# EAGLE design ESP_ART_NET (EAGLE 7.5.0)
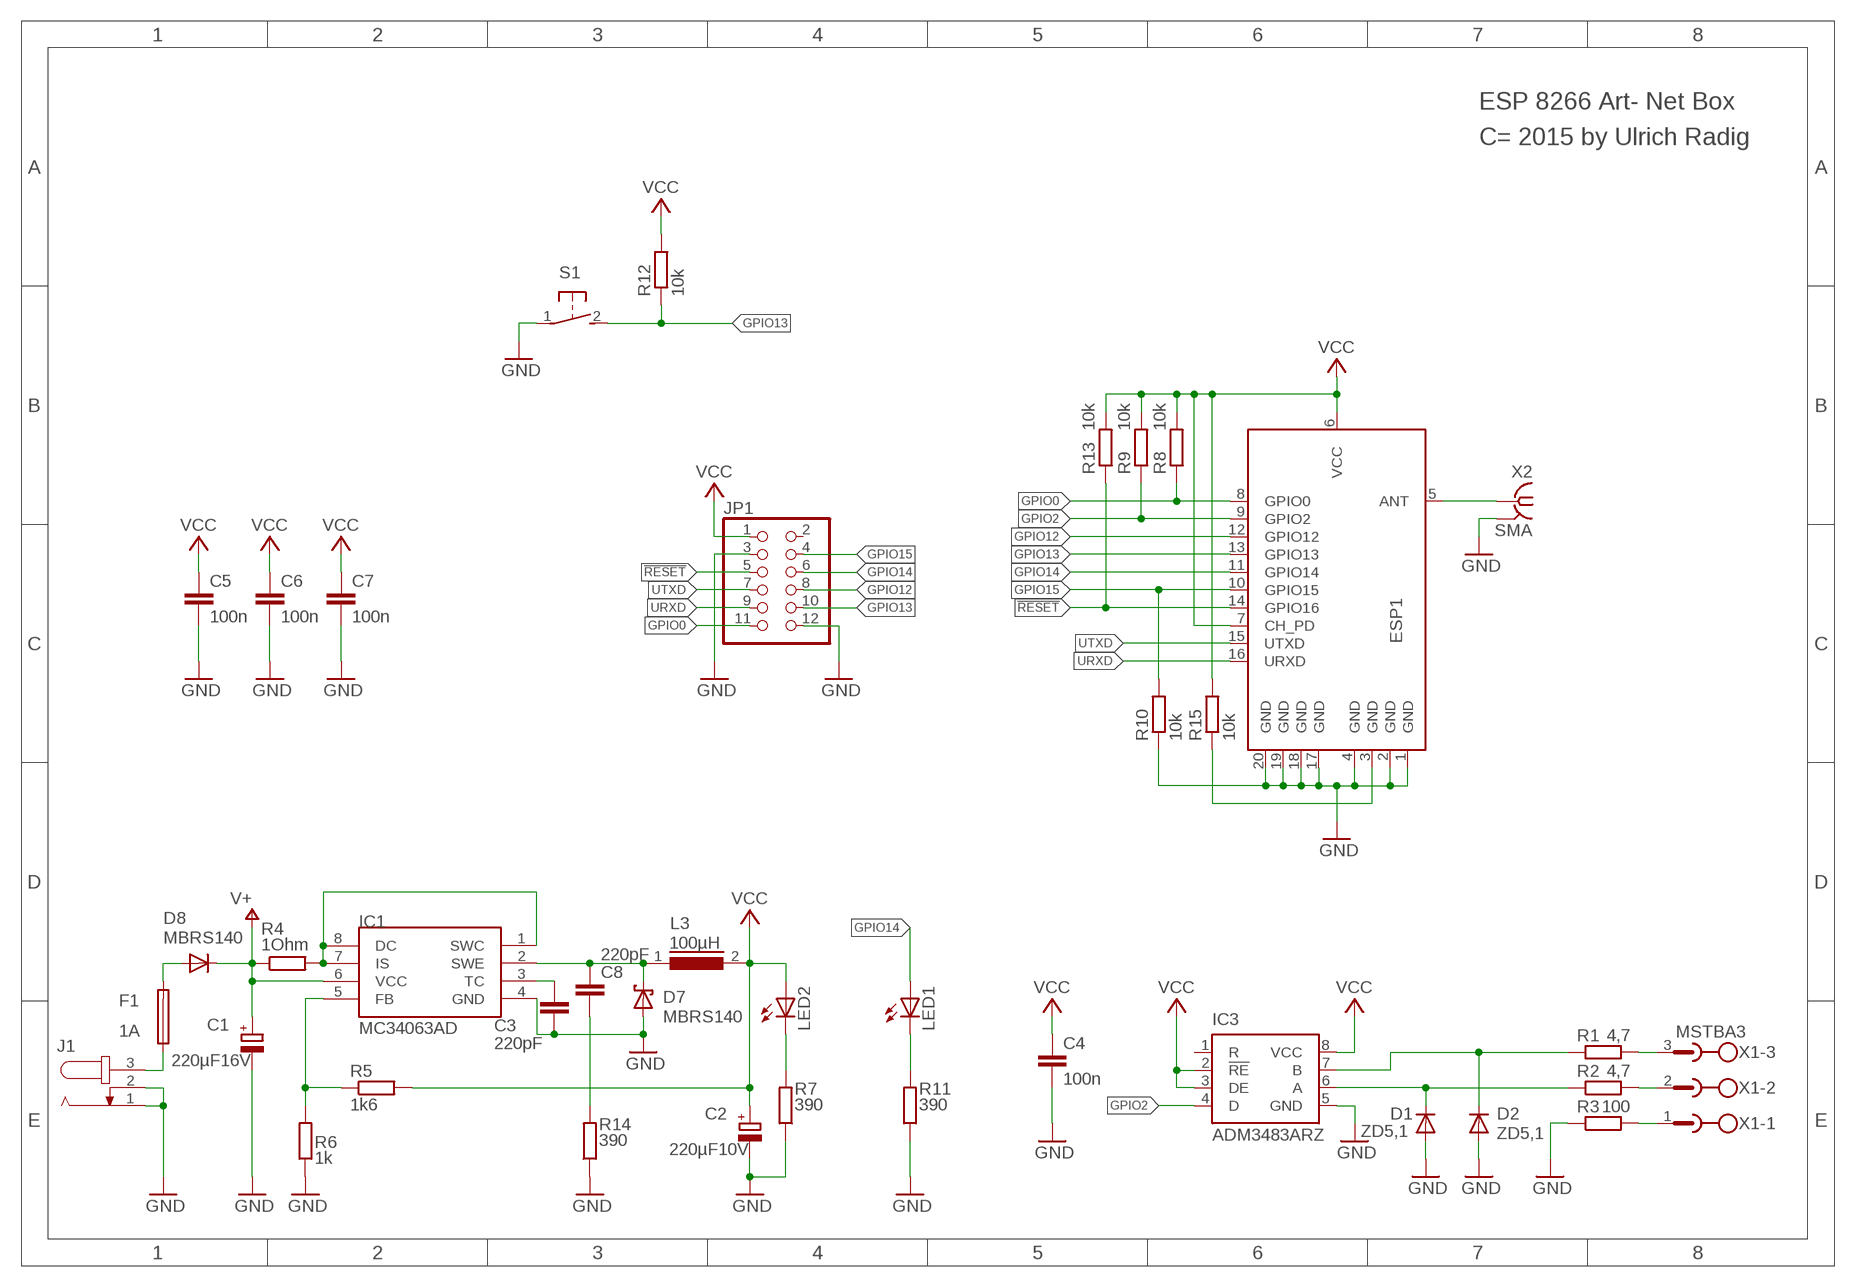
[diagram p0: schematic, sheet 1]

## Parts
C1  220µF16V  CPOL-EUE5-8.5  [E5-8,5]
C2  220µF10V  CPOL-EUE2.5-7  [E2,5-7]
C3  220pF  C-EUC0805  [C0805]
C4  100n  C-EUC0805  [C0805]
C5  100n  C-EUC0805  [C0805]
C6  100n  C-EUC0805  [C0805]
C7  100n  C-EUC0805  [C0805]
C8  220pF  C-EUC0805  [C0805]
D1  ZD5,1  PMLL4150  [SOD80C]
D2  ZD5,1  PMLL4150  [SOD80C]
D7  MBRS140  SCHOTTKY-DIODESMD  [SMB]
D8  MBRS140  DIODE-SMB  [SMB]
ESP1  ESP8266MOD  [ESP8266MOD]
F1  1A  PICOFUSE  [PICOFUSE]
IC1  MC34063AD  [SOIC8]
IC3  ADM3483ARZ  SN65176D  [SO-08]
J1  JACK-PLUG1  [SPC4078]
JP1  PINHD-2X6  [2X06]
L3  100µH  SLF7045  [SLF7045]
LED1  LEDCHIPLED_1206  [CHIPLED_1206]
LED2  LEDCHIPLED_1206  [CHIPLED_1206]
R1  4,7  R-EU_R0805  [R0805]
R2  4,7  R-EU_R0805  [R0805]
R3  100  R-EU_R0805  [R0805]
R4  1Ohm  R-EU_0207/10  [0207/10]
R5  1k6  R-EU_M0805  [M0805]
R6  1k  R-EU_M0805  [M0805]
R7  390  R-EU_R0805  [R0805]
R8  10k  R-EU_R0805  [R0805]
R9  10k  R-EU_R0805  [R0805]
R10  10k  R-EU_R0805  [R0805]
R11  390  R-EU_R0805  [R0805]
R12  10k  R-EU_R0805  [R0805]
R13  10k  R-EU_R0805  [R0805]
R14  390  R-EU_R0805  [R0805]
R15  10k  R-EU_R0805  [R0805]
S1  31-XX  [B3F-31XX]
X1  MSTBA3  [MSTBA3]
X2  SMA  SMA-142-0701-801/806  [J502-ND-142-0701-801/806]

## Nets
!RESET: ESP1.14(GPIO16) JP1.5 R13.1
GND: C1.- C2.- C3.2 C4.2 C5.2 C6.2 C7.2 D1.A D2.A D7.A ESP1.1(GND) ESP1.2(GND) ESP1.4(GND) ESP1.17(GND) ESP1.18(GND) ESP1.19(GND) ESP1.20(GND) IC1.4(GND) IC3.5(GND) J1.1 J1.2 JP1.3 JP1.12 R3.1 R6.1 R7.1 R10.1 R11.1 R14.1 S1.1(P) X2.G@1(GND)
GPIO0: ESP1.8(GPIO0) JP1.11 R8.1
GPIO2: ESP1.9(GPIO2) IC3.4(D) R9.1
GPIO12: ESP1.12(GPIO12) JP1.8
GPIO13: ESP1.13(GPIO13) JP1.10 R12.1 S1.2(S)
GPIO14: ESP1.11(GPIO14) JP1.6 LED1.A
GPIO15: ESP1.10(GPIO15) JP1.4 R10.2
N$1: LED2.C R7.2
N$2: ESP1.5(ANT) X2.1
N$3: LED1.C R11.2
N$4: D1.C IC3.6(A) R2.1
N$5: D2.C IC3.7(B) R1.1
N$6: R3.2 X1.1
N$7: R2.2 X1.2
N$8: R1.2 X1.3
N$9: C8.2 R14.2
N$10: ESP1.3(GND) R15.1
N$51: IC1.5(FB) R5.1 R6.2
N$52: C3.1 IC1.3(TC)
N$53: IC1.1(SWC) IC1.7(IS) IC1.8(DC) R4.2
N$54: C8.1 D7.C IC1.2(SWE) L3.1
N$57: D8.A F1.2
N$58: F1.1 J1.3
URXD: ESP1.16(URXD) JP1.9
UTXD: ESP1.15(UTXD) JP1.7
V+: C1.+ D8.C IC1.6(VCC) R4.1
VCC: C2.+ C4.1 C5.1 C6.1 C7.1 ESP1.6(VCC) ESP1.7(CH_PD) IC3.2(!RE) IC3.3(DE) IC3.8(VCC) JP1.1 L3.2 LED2.A R5.2 R8.2 R9.2 R12.2 R13.2 R15.2
Unconnected: IC3.1(R) JP1.2

## Notes on the sheet
- ESP 8266 Art- Net Box
- C= 2015 by Ulrich Radig

## Power pins joined to a net without a drawn wire
GND: X2.G@2(GND) X2.G@3(GND) X2.G@4(GND)

## Library data of the parts
C1 C2 = rcl:CPOL-EU: POLARIZED CAPACITOR, European symbol
C3-C8 = rcl:C-EU: CAPACITOR, European symbol
D1 D2 = diode:PMLL4150: DIODE high speed
D7 = diode:SCHOTTKY-DIODE: Schottky Diode
D8 = diode:DIODE-: DIODE
ESP1 = ESP8266:ESP8266MOD
F1 = fuse:PICOFUSE: PICOFUSE 19275, Wickmann
IC1 = mc34063:MC34063
IC3 = texas:SN65176: DIFFERENTIAL BUS TRANSCEIVER Source: http://focus.ti.com .. sn65176b.pdf
J1 = con-jack:JACK-PLUG: DC POWER JACK Power Jack, DC, Right Angle, Through Hole, Rated 5A at 16VDC, PC Terminals Distributor: Farnell (www.Farnell.de) Drawing: 84N1161.pdf / 84N1162.pdf Manufacturer: SPC Technology (www.spctechnology.com) Type: SPC4077 / SPC 4078
JP1 = pinhead:PINHD-2X6: PIN HEADER
L3 = inductors:SLF7045: SMD Inductors(Coils) For Power Line (Wound, Magnetic Shielded) Source: TDK, e531_slf7045.pdf
LED1 LED2 = led:LED: LED OSRAM: - CHIPLED LG R971, LG N971, LY N971, LG Q971, LY Q971, LO R971, LY R971 LH N974, LH R974 LS Q976, LO Q976, LY Q976 LO Q996 - Hyper CHIPLED LW Q18S LB Q993, LB Q99A, LB R99A - SideLED LS A670, LO A670, LY A670, LG A670, LP A670 LB A673, LV A673, LT A673, LW A673 LH A674 LY A675 LS A676, LA A676, LO A676, LY A676, LW A676 LS A679, LY A679, LG A679 - Hyper Micro SIDELED® LS Y876, LA Y876, LO Y876, LY Y876 LT Y87S - SmartLED LW L88C, LW L88S LB L89C, LB L89S, LG L890 LS L89K, LO L89K, LY L89K LS L896, LA L896, LO L896, LY L896 - TOPLED LS T670, LO T670, LY T670, LG T670, LP T670 LSG T670, LSP T670, LSY T670, LOP T670, LYG T670 LG T671, LOG T671, LSG T671 LB T673, LV T673, LT T673, LW T673 LH T674 LS T676, LA T676, LO T676, LY T676, LB T676, LH T676, LSB T676, LW T676 LB T67C, LV T67C, LT T67C, LS T67K, LO T67K, LY T67K, LW E67C LS E67B, LA E67B, LO E67B, LY E67B, LB E67C, LV E67C, LT E67C LW T67C LS T679, LY T679, LG T679 LS T770, LO T770, LY T770, LG T770, LP T770 LB T773, LV T773, LT T773, LW T773 LH T774 LS E675, LA E675, LY E675, LS T675 LS T776, LA T776, LO T776, LY T776, LB T776 LHGB T686 LT T68C, LB T68C - Hyper Mini TOPLED® LB M676 - Mini TOPLED Santana® LG M470 LS M47K, LO M47K, LY M47K Source: http://www.osram.convergy.de LUXEON: - LUMILED® LXK2-PW12-R00, LXK2-PW12-S00, LXK2-PW14-U00, LXK2-PW14-V00 LXK2-PM12-R00, LXK2-PM12-S00, LXK2-PM14-U00 LXK2-PE12-Q00, LXK2-PE12-R00, LXK2-PE12-S00, LXK2-PE14-T00, LXK2-PE14-U00 LXK2-PB12-K00, LXK2-PB12-L00, LXK2-PB12-M00, LXK2-PB14-N00, LXK2-PB14-P00, LXK2-PB14-Q00 LXK2-PR12-L00, LXK2-PR12-M00, LXK2-PR14-Q00, LXK2-PR14-R00 LXK2-PD12-Q00, LXK2-PD12-R00, LXK2-PD12-S00 LXK2-PH12-R00, LXK2-PH12-S00 LXK2-PL12-P00, LXK2-PL12-Q00, LXK2-PL12-R00 Source: www.luxeon.com KINGBRIGHT: KA-3528ASYC Source: www.kingbright.com
R1-R15 = rcl:R-EU_: RESISTOR, European symbol
S1 = switch-omron:31-XX: OMRON SWITCH
X1 = con-phoenix-508:MSTBA3: PHOENIX
X2 = con-coax:SMA-: SMA 50 Ohm End Launch Jack Receptacle - Round Contact Johnson Components Source: www.johnsoncomponents.com .. J502-ND.pdf

## Board
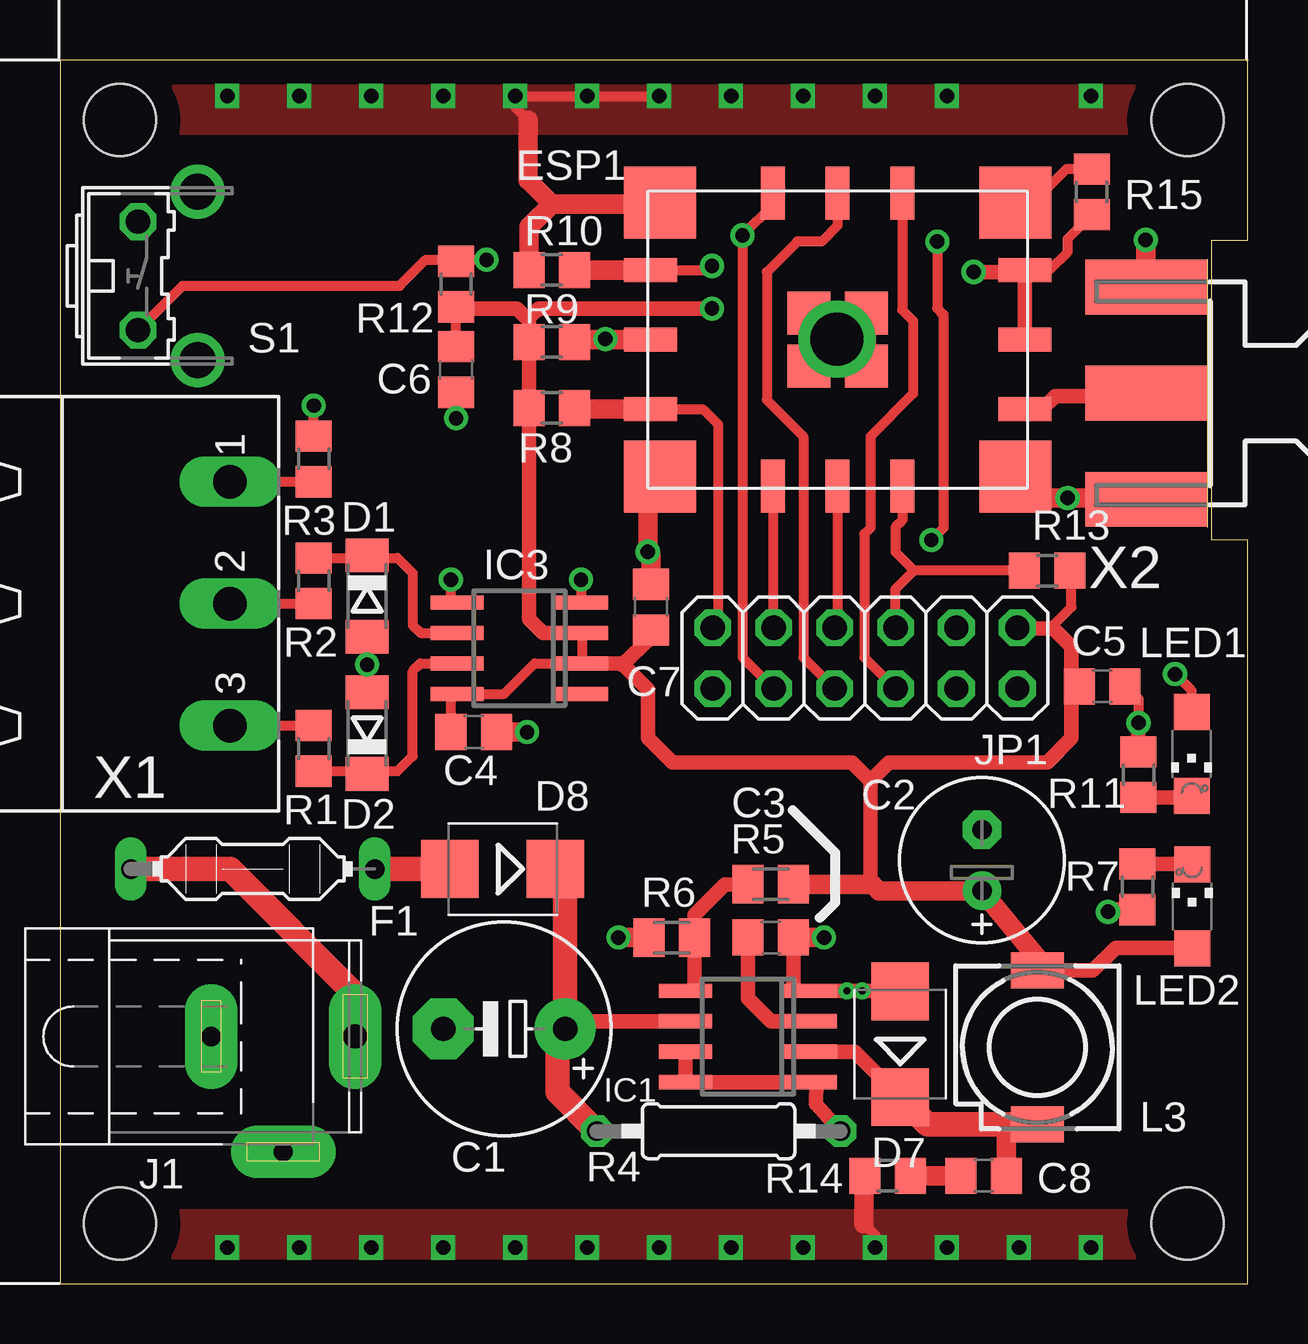
[diagram p1: board, top side]
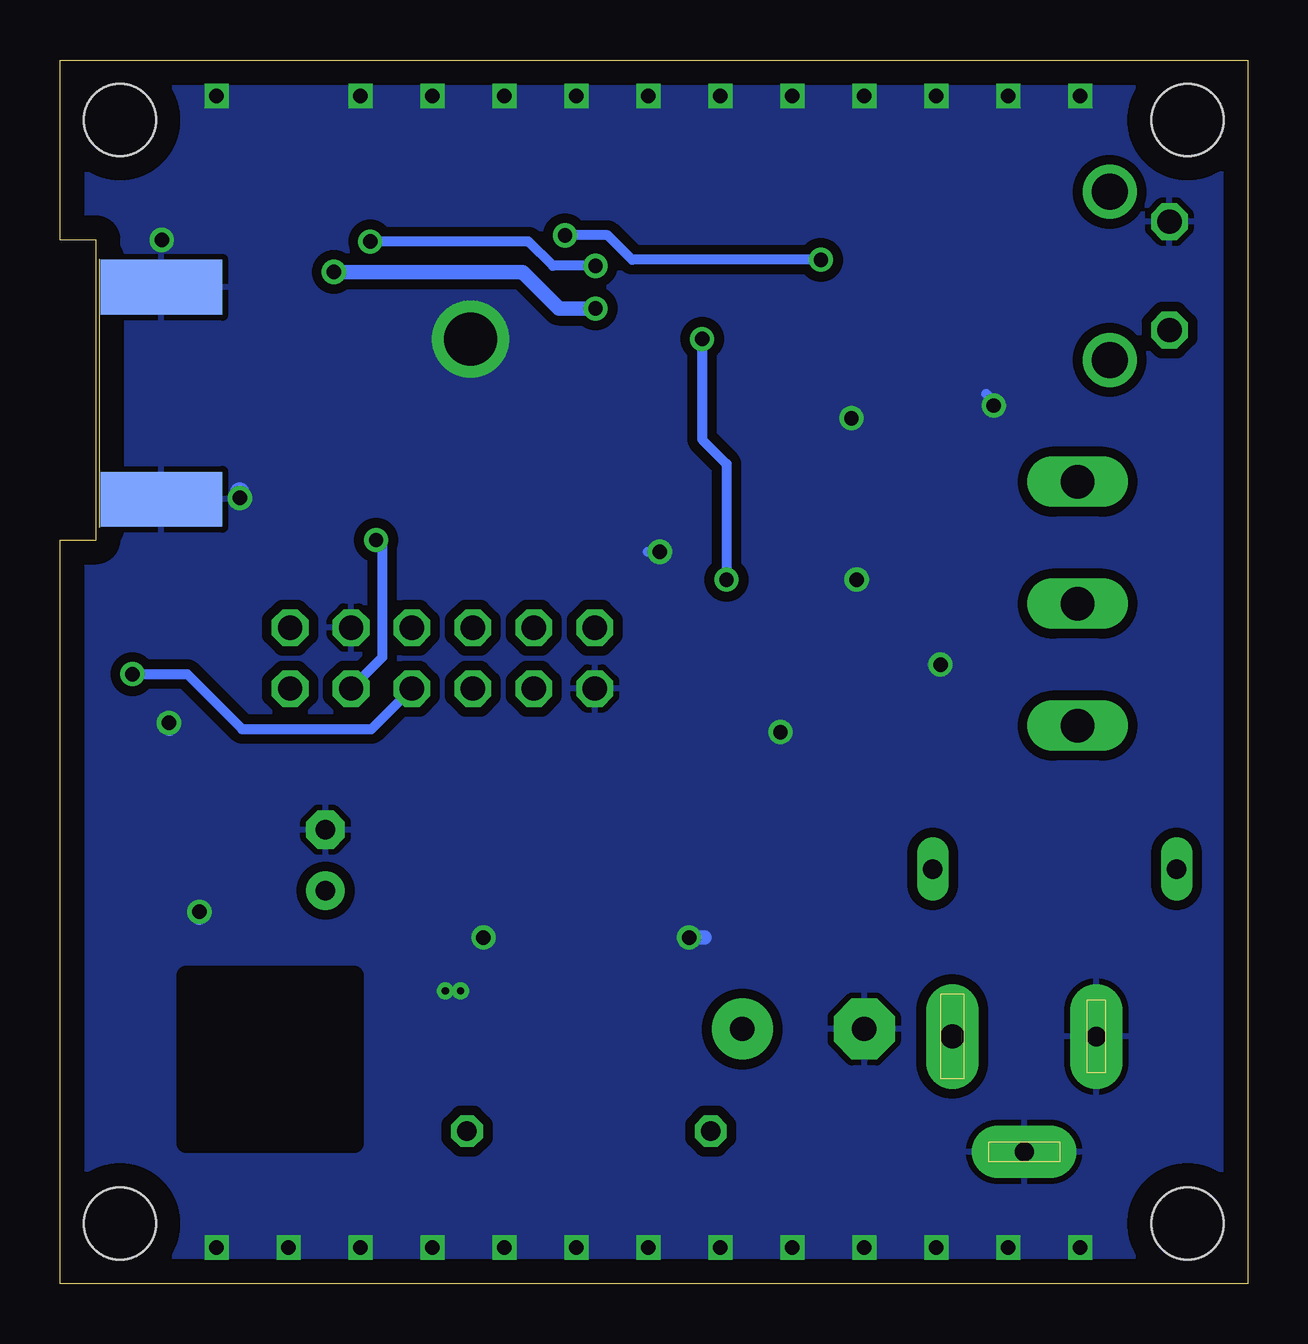
[diagram p2: board, bottom side, seen from below]

Size 49.5 x 51 mm. Coordinates in mm from the lower left corner, seen from the top.
Outline: 0,0 49.5,0 49.5,31 48,31 48,43.5 49.5,43.5 49.5,51 0,51 0,0
Copper layers (1*16): Top 0.035mm / dielectric 1.5mm / Bottom 0.035mm
Design rules "default": minimum track width 10mil, minimum drill 24mil, track to track 8mil, track to pad 8mil, pad to pad 8mil, via to via 8mil, smd to smd 8mil, copper to edge 40mil, drill to drill 8mil, minimum pad ring 10mil, minimum via ring 8mil, stop-mask expansion 4mil, vias tented up to drill 0mil, thermal gap 10mil
Holes 3 mm at 47,48.5 47,2.5 2.5,2.5 2.5,48.5
bRestrict: area 37.2,5.9 to 44.2,12.8

### Footprints (pad centres in the part's own frame; a part is rotated, then mirrored left to right if it is on the bottom)
E5-8,5 = drill 1.016 pad 2.54: + -2.54,0 | drill 1.016 pad 2.54 octagon: - 2.54,0
E2,5-7 = drill 0.813 pad 1.6: + -1.27,0 | drill 0.813 pad 1.6 octagon: - 1.27,0
C0805 = smd 1.3 x 1.5: 1 -0.95,0; 2 0.95,0
SOD80C = smd 1.4 x 1.8: A 1.7,0; C -1.7,0
SMB = smd 2.4 x 2.4: A 2.2,0; C -2.2,0
ESP8266MOD = smd 3 x 3: 1 -7.4,5.7; 2 7.4,5.7; 3 -7.4,-5.7; 4 7.4,-5.7 | smd 2.2 x 1: 5 -7.8,2.9; 6 -7.8,0; 7 -7.8,-2.9; 8 7.8,2.9; 9 7.8,0; 10 7.8,-2.9 | smd 1 x 2.2: 11 -2.7,-6.1; 12 0,-6.1; 13 2.7,-6.1; 14 -2.7,6.1; 15 0,6.1; 16 2.7,6.1 | smd 1.8 x 1.8: 17 -1.2,1.1; 18 1.2,1.1; 19 -1.2,-1.1; 20 1.2,-1.1
PICOFUSE = drill 0.813 long: 1 -5.08,0; 2 5.08,0
SOIC8 = smd 0.6 x 2.2: 1 -1.905,-2.6; 2 -0.635,-2.6; 3 0.635,-2.6; 4 1.905,-2.6; 5 1.905,2.6; 6 0.635,2.6; 7 -0.635,2.6; 8 -1.905,2.6
SO-08 = smd 0.6 x 2.2: 1 -1.905,-2.6; 2 -0.635,-2.6; 3 0.635,-2.6; 4 1.905,-2.6; 5 1.905,2.6; 6 0.635,2.6; 7 -0.635,2.6; 8 -1.905,2.6
SPC4078 = drill 0.8 pad 2.184 long: 1 -3,0; 2 0,-4.8 | drill 1 pad 2.184 long: 3 3,0
2X06 = drill 1.016 octagon: 1 -6.35,-1.27; 2 -6.35,1.27; 3 -3.81,-1.27; 4 -3.81,1.27; 5 -1.27,-1.27; 6 -1.27,1.27; 7 1.27,-1.27; 8 1.27,1.27; 9 3.81,-1.27; 10 3.81,1.27; 11 6.35,-1.27; 12 6.35,1.27
SLF7045 = smd 1.5 x 2.2: 1 -3.2,0; 2 3.2,0
CHIPLED_1206 = smd 1.5 x 1.5: A 0,-1.75; C 0,1.75
R0805 = smd 1.3 x 1.5: 1 -0.95,0; 2 0.95,0
0207/10 = drill 0.813 octagon: 1 -5.08,0; 2 5.08,0
M0805 = smd 1.3 x 1.6: 1 -0.95,0; 2 0.95,0
B3F-31XX = drill 1.016 octagon: 1 -2.261,-1.245; 2 2.261,-1.245 | drill 1.499 pad 2.159: 3 -3.505,1.245; 4 3.505,1.245
MSTBA3 = drill 1.397 long: 1 -5.08,5.08; 2 0,5.08; 3 5.08,5.08
J502-ND-142-0701-801/806 = smd 5.08 x 2.286: 1 2.565,0; G@1 2.565,4.42; G@2 2.565,-4.42 | smd 5.08 x 2.286 bottom: G@3 2.565,4.42; G@4 2.565,-4.42

### Placement (x,y rotation side)
C1  18.52,10.61 180 top
C2  38.43,17.64 90 top
C3  29.63,14.42 0 top
C4  17.25,22.99 0 top
C5  43.43,24.89 0 top
C6  16.51,38.1 270 top
C7  24.64,28.19 90 top
C8  38.5,4.5 180 top
D1  12.8,28.66 270 top
D2  12.8,22.94 90 top
D7  35.02,9.98 90 top
D8  18.45,17.28 180 top
ESP1  32.41,39.34 180 top
F1  8.04,17.28 0 top
IC1  28.68,10.29 90 top
IC3  19.15,26.48 90 top
J1  9.31,10.29 0 top
JP1  33.56,26.07 180 top
L3  40.74,9.84 90 top
LED1  47.17,22.07 180 top
LED2  47.19,15.72 0 top
R1  10.58,22.3 90 top
R2  10.58,29.29 270 top
R3  10.58,34.37 270 top
R4  27.45,6.35 0 top
R5  29.63,16.64 0 top
R6  25.5,14.42 0 top
R7  44.91,16.54 90 top
R8  20.5,36.5 180 top
R9  20.5,39.25 180 top
R10  20.5,42.25 0 top
R11  44.96,21.21 270 top
R12  16.51,41.66 270 top
R13  41.15,29.72 0 top
R14  34.5,4.5 0 top
R15  43,45.5 270 top
S1  4.5,42 270 top
X1  2,28.34 270 top
X2  47.84,37.11 180 top

### Tracks (layer width: path | path; a pad name or v marks a point on that pad's centre or on a via)
!RESET
  Top 0.406: JP1.5 34.83,28.96 35.59,29.72 | ESP1.14 35.11,31.81 34.83,31.52 34.83,30.48 35.59,29.72 | R13.1 35.59,29.72
GND  (via drill 0.3, 0.6, 2.2)
  Top 0.406: R3.1 v10.58,36.59 | D2.A v12.8,25.8 D1.A | IC3.5 16.29,28.39 v16.29,29.34 | v32.38,39.37 33.48,39.37 33.61,39.5 | C5.2 44.45,24.89 44.96,24.38 v44.96,23.37 | C6.2 v16.51,36.07 | R14.1 33.5,4.45 | 33.5,2.5 33.98,2.02 v33.98,1.5 | ESP1.2 25.01,33.01 24.5,32.5 | 25.01,49.46 19.04,49.46 19,49.5 19,49 19.5,48.5
  Top 0.61: D7.A 34.71,12.2 v33.44,12.2 v32.8,12.2 IC1.4 30.58,12.2 C3.2 | R11.1 v44.96,23.37 | R7.1 43.78,15.59 v43.69,15.49 | 24.64,33.36 24.5,33.5
  Top 0.813: R6.1 v23.28,14.42 | C3.2 v31.85,14.42 | C4.2 v19.47,22.99 | 25.01,49.46 v24.98,49.5 | X2.G@3 44.71,32.75 v42,32.75 40.75,32.75 39.85,33.39 ESP1.1 | v45.25,43.5 45.25,41.55 X2.G@4 | ESP1.2 24.64,33.65 24.5,33.5 | ESP1.20 ESP1.18 ESP1.17 33.61,39.5 ESP1.19 | ESP1.19 33.61,40.5 31.5,40.5 31.5,40.45 ESP1.19 | R10.1 19.55,44.05 20.5,45 | 20.5,45 24.97,45 ESP1.4 | 33.5,4.45 33.5,2.5 | C7.2 24.64,30.36 v24.5,30.5 24.5,32.5 | 19.5,48.5 19.5,46 20.5,45
  Bottom 0.406: v10.58,36.59 10.89,37.09 | v12.8,25.8 13.12,25.8 | v16.29,29.34 16.29,29.66 | v16.51,36.07 16.51,36.32 | v24.5,30.5 25,30.5
  Bottom 0.61: v23.28,14.42 22.64,14.42 | v44.96,23.37 44.96,23.11 | v43.69,15.49 43.69,15.24
  Bottom 0.813: v42,32.75 42.01,33
  other vias: 6.97,1.5 9.97,1.5 12.97,1.5 15.97,1.5 18.98,1.5 21.98,1.5 24.98,1.5 27.98,1.5 30.98,1.5 36.98,1.5 39.98,1.5 42.98,1.5 6.97,49.5 9.97,49.5 12.97,49.5 15.97,49.5 18.98,49.5 21.98,49.5 27.98,49.5 30.98,49.5 33.98,49.5 36.98,49.5 42.98,49.5
  pour Bottom (isolate 0.406): -0.03,51 49.48,51 49.48,0 -0.03,0
  pour Top: -0.03,51 49.48,51 49.48,48 -0.03,48
  pour Top (isolate 0.254): -0.03,0 -0.03,3 49.48,3 49.48,0
GPIO0
  Top 0.406: ESP1.8 26.8,36.45 27.43,35.81 27.43,27.57 JP1.11
  Top 0.813: ESP1.8 21.45,36.45 R8.1
GPIO2  (via drill 0.6)
  Top 0.406: R9.1 22.61,39.25 v22.73,39.37 | v21.72,29.34 21.72,28.42 IC3.4
  Top 0.813: ESP1.9 21.45,39.34 R9.1
  Bottom 0.406: v22.73,39.37 22.73,35.18 21.72,34.16 v21.72,29.34
GPIO12
  Top 0.406: ESP1.12 32.41,44.1 31.75,43.43 30.73,43.43 29.46,42.16 29.46,36.83 30.99,35.31 30.99,26.1 JP1.8
GPIO13  (via drill 0.6)
  Top 0.406: ESP1.13 29.71,44.95 v28.45,43.69 28.45,26.1 JP1.10 | S1.2 5.11,41.59 14.16,41.59 15.24,42.67 16.51,42.67 R12.1 16.58,42.67 v17.78,42.67
  Bottom 0.406: v17.78,42.67 25.65,42.67 26.67,43.69 v28.45,43.69
GPIO14  (via drill 0.6)
  Top 0.406: ESP1.11 35.11,40.58 35.56,40.13 35.56,37.08 33.78,35.31 33.78,31.5 33.53,31.24 33.53,26.1 JP1.6 | LED1.A 47.17,24.71 v46.48,25.4
  Bottom 0.406: v46.48,25.4 44.2,25.4 41.91,23.11 36.51,23.11 JP1.6
GPIO15  (via drill 0.6)
  Top 0.406: ESP1.10 27,42.24 v27.18,42.42 | v36.57,43.43 36.57,40.65 36.83,40.39 36.83,31.5 v36.32,30.99
  Top 0.813: ESP1.10 21.7,42.24 arc-90 R10.2
  Bottom 0.406: v27.18,42.42 28.96,42.42 29.97,43.43 v36.57,43.43 | v36.32,30.99 36.07,30.73 36.07,26.1 JP1.4
N$1
  Top 0.61: R7.2 47.17,17.49 LED2.C
N$2
  Top 0.406: 45.16,37 X2.1
  Top 0.61: ESP1.5 40.93,36.45 41.48,37 45.16,37
N$3
  Top 0.61: R11.2 47.1,20.26 LED1.C
N$4
  Top 0.406: R2.1 12.8,30.24 | 12.8,30.24 D1.C | 12.8,30.24 14.07,30.24 14.71,29.61 14.71,27.43 15.02,27.11 IC3.6
N$5
  Top 0.406: R1.1 12.8,21.36 | 12.8,21.36 D2.C | 12.8,21.36 14.07,21.36 14.71,21.99 14.71,25.53 15.02,25.84 IC3.7
N$6
  Top 0.406: X1.1 R3.2
N$7
  Top 0.406: X1.2 R2.2
N$8
  Top 0.406: X1.3 R1.2
N$9
  Top 0.813: R14.2 C8.2
N$10
  Top 0.406: R15.1 41.95,46.45 40.5,45 39.86,45 ESP1.3
N$51
  Top 0.61: IC1.5 26.45,12.2 R6.2 26.45,15.37 27.72,16.64 R5.1
N$52
  Top 0.61: IC1.3 29.63,10.93 28.68,11.88 C3.1
N$53
  Top 0.61: R4.2 31.5,7.5 31.53,8.39 IC1.1 IC1.8 IC1.7
N$54
  Top 0.406: 39.45,6.64 39,6.64
  Top 0.61: IC1.2 33.14,9.66 D7.C
  Top 0.813: C8.1 39.45,6.64
  Top 1.016: L3.1 39,6.64 36.16,6.64 D7.C
N$57
  Top 1.016: F1.2 D8.A
N$58
  Top 1.016: F1.1 7.08,17.28 12.31,12.06 J1.3
URXD
  Top 0.406: ESP1.16 29.71,27.37 JP1.9
UTXD
  Top 0.406: ESP1.15 32.41,27.47 JP1.7
V+
  Top 0.61: IC1.6 21.31,10.93 20.99,10.61 C1.+
  Top 1.016: D8.C 20.91,17.26 21.05,16.64 C1.+ 20.74,10.29 20.74,7.99 R4.1
VCC  (via drill 0.6)
  Top 0.406: IC3.3 IC3.2 19.79,25.84 18.52,24.57 IC3.8 16.3,24.32 C4.1 | ESP1.6 ESP1.7 40.26,42.29 | 40.26,42.29 39.62,42.29 39.5,42.16 | R9.2 | 19.56,40.26 19.43,40.26 | 16.58,40.64 R12.2 C6.1 | C5.1 42.16,24.89 | JP1.1 41.31,27.34 42.16,28.19 42.16,29.65 R13.2 | 40.26,42.29 41.29,42.29 42,43 42,43.55 R15.2
  Top 0.61: L3.2 43.04,13.04 44,14 47.16,14 LED2.A | R9.2 R8.2 19.55,27.69 20.13,27.11 IC3.3 | ESP1.6 ESP1.7 | 39.5,42.16 v38.08,42.16 | v27.18,40.64 27.18,40.77 27.05,40.64 19.94,40.64 19.56,40.26 R9.2 | IC3.2 23.43,25.84 | 23.43,25.84 24.51,24.77 24.51,22.73 25.53,21.72 33.02,21.72 33.78,20.95 | 33.78,20.95 33.78,16.72 33.85,16.64 | 33.78,20.95 34.54,21.72 41.15,21.72 42.16,22.73 42.16,24.89 42.16,26.54 41.4,27.3 39.94,27.3 JP1.1 | 19.43,40.26 19.05,40.64 16.58,40.64 | 23.43,25.84 23.43,25.78 24.64,26.92 C7.1
  Top 0.813: L3.2 40.74,13.56 C2.+ 34.12,16.38 33.85,16.64 R5.2
  Bottom 0.61: v38.08,42.16 30.23,42.16 28.7,40.64 v27.18,40.64